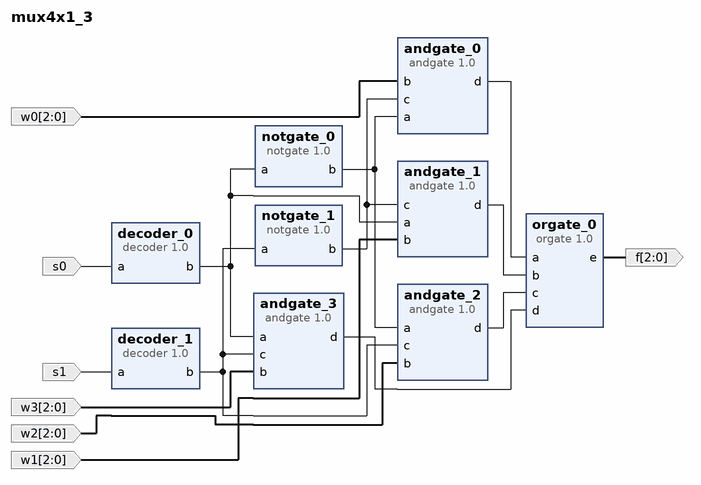
[diagram p0: block diagram of the top level]
# Vivado block design mux4x1_3, Vivado 2015.2
create_bd_design mux4x1_3

create_bd_port -dir O -from 2 -to 0 f
create_bd_port -dir I s1
create_bd_port -dir I s0
create_bd_port -dir I -from 2 -to 0 w0
create_bd_port -dir I -from 2 -to 0 w1
create_bd_port -dir I -from 2 -to 0 w2
create_bd_port -dir I -from 2 -to 0 w3

create_bd_cell -type ip -vlnv xilinx.com:user:decoder:1.0 decoder_0
create_bd_cell -type ip -vlnv xilinx.com:user:decoder:1.0 decoder_1
create_bd_cell -type ip -vlnv xilinx.com:user:andgate:1.0 andgate_0
set_property -dict {CONFIG.WIDTH 3} [get_bd_cells andgate_0]
create_bd_cell -type ip -vlnv xilinx.com:user:andgate:1.0 andgate_1
set_property -dict {CONFIG.WIDTH 3} [get_bd_cells andgate_1]
create_bd_cell -type ip -vlnv xilinx.com:user:andgate:1.0 andgate_2
set_property -dict {CONFIG.WIDTH 3} [get_bd_cells andgate_2]
create_bd_cell -type ip -vlnv xilinx.com:user:andgate:1.0 andgate_3
set_property -dict {CONFIG.WIDTH 3} [get_bd_cells andgate_3]
create_bd_cell -type ip -vlnv xilinx.com:user:orgate:1.0 orgate_0
set_property -dict {CONFIG.WIDTH 3} [get_bd_cells orgate_0]
create_bd_cell -type ip -vlnv xilinx.com:user:notgate:1.0 notgate_0
set_property -dict {CONFIG.WIDTH 3} [get_bd_cells notgate_0]
create_bd_cell -type ip -vlnv xilinx.com:user:notgate:1.0 notgate_1
set_property -dict {CONFIG.WIDTH 3} [get_bd_cells notgate_1]

# ---- connections ----

connect_bd_net [get_bd_pins orgate_0/e] [get_bd_ports f]
connect_bd_net -net s1_1 [get_bd_ports s1] [get_bd_pins decoder_1/a]
connect_bd_net -net s0_1 [get_bd_ports s0] [get_bd_pins decoder_0/a]
connect_bd_net [get_bd_pins decoder_0/b] [get_bd_pins notgate_0/a] [get_bd_pins andgate_3/a] [get_bd_pins andgate_1/a]
connect_bd_net [get_bd_pins decoder_1/b] [get_bd_pins notgate_1/a] [get_bd_pins andgate_3/c] [get_bd_pins andgate_2/c]
connect_bd_net [get_bd_pins notgate_1/b] [get_bd_pins andgate_0/c] [get_bd_pins andgate_1/c]
connect_bd_net [get_bd_pins andgate_0/d] [get_bd_pins orgate_0/a]
connect_bd_net [get_bd_pins andgate_1/d] [get_bd_pins orgate_0/b]
connect_bd_net [get_bd_pins andgate_2/d] [get_bd_pins orgate_0/c]
connect_bd_net [get_bd_pins andgate_3/d] [get_bd_pins orgate_0/d]
connect_bd_net -net w3_1 [get_bd_ports w3] [get_bd_pins andgate_3/b]
connect_bd_net -net w2_1 [get_bd_ports w2] [get_bd_pins andgate_2/b]
connect_bd_net -net w1_1 [get_bd_ports w1] [get_bd_pins andgate_1/b]
connect_bd_net -net w0_1 [get_bd_ports w0] [get_bd_pins andgate_0/b]
connect_bd_net [get_bd_pins notgate_0/b] [get_bd_pins andgate_0/a] [get_bd_pins andgate_2/a]

validate_bd_design
save_bd_design
